# Altium project gongxuanke.PrjPcb
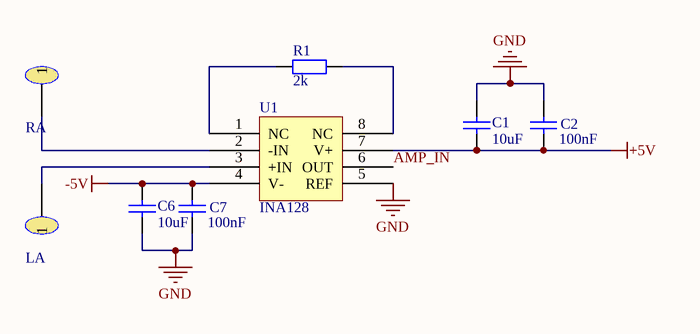
[diagram p0: 前级仪表放大.SchDoc]
13 sheets, 104 parts. Net scope: global (net labels, ports and power ports of the same name join across sheets).
Sheets:
  前级仪表放大.SchDoc
  低通&放大.SchDoc
  100Hz陷波&电平移位&放大.SchDoc
  无源高通.SchDoc
  50Hz陷波器（两次陷波）.SchDoc
  电源电路.SchDoc
  LCD.SchDoc
  启动模式.SchDoc
  晶振.SchDoc
  复位.SchDoc
  暂停.SchDoc
  下载&调试.SchDoc
  主控.SchDoc

## Sheet 前级仪表放大.SchDoc
size A4

### Parts
C1  10uF  [LC-0805_C]
C2  100nF  [LC-0805_C]
C6  10uF  [LC-0805_C]
C7  100nF  [LC-0805_C]
LA  ���Ժ���  [PAD]  (value not drawn)
R1  2k  [LC-0805_R]
RA  ���Ժ���  [PAD]  (value not drawn)
U1  INA128  [LC-SOIC-8_150mil]

### Nets
+5V: C1.2 C2.2 U1.7(V+)
-5V: C6.1 C7.1 U1.4(V-)
GND: C1.1 C2.1 C6.2 C7.2 U1.5(REF)
AMP_IN: U1.6(OUT)
NetLA_1: LA.1 U1.3(+IN)
NetR1_1: R1.1 U1.1(NC)
NetR1_2: R1.2 U1.8(NC)
NetRA_1: RA.1 U1.2(-IN)

### Library data of the parts
C1 C2 C6 C7 = Cap: 100nF��0805��50V,+/-10%
LA RA = TestPoint: ��������
R1 = Res1: 330��,0805,��5%
U1 = INA128: INA128��SO-8

## Sheet 低通&放大.SchDoc
size A4
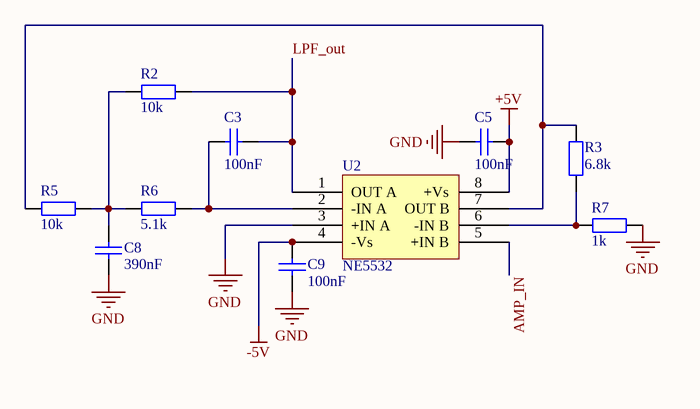
[diagram p1: 低通&放大.SchDoc]

### Parts
C3  100nF  [LC-0805_C]
C5  100nF  [LC-0805_C]
C8  390nF  [LC-0805_C]
C9  100nF  [LC-0805_C]
R2  10k  [LC-0805_R]
R3  6.8k  [LC-0805_R]
R5  10k  [LC-0805_R]
R6  5.1k  [LC-0805_R]
R7  1k  [LC-0805_R]
U2  NE5532  [DIP-8]

### Nets
+5V: C5.2 U2.8(+Vs)
-5V: C9.1 U2.4(-Vs)
GND: C5.1 C8.2 C9.2 R7.2 U2.3(+IN_A)
AMP_IN: U2.5(+IN_B)
LPF_out: C3.2 R2.2 U2.1(OUT_A)
NetC3_1: C3.1 R6.2 U2.2(-IN_A)
NetC8_1: C8.1 R2.1 R5.2 R6.1
NetR3_1: R3.1 R7.1 U2.6(-IN_B)
NetR3_2: R3.2 R5.1 U2.7(OUT_B)

### Library data of the parts
C3 C5 C8 C9 = Cap: 100nF��0805��50V,+/-10%
R2 R3 R5-R7 = R: 10k��,0805,��5%
U2 = NE5532: NE5532��SO-8

## Sheet 100Hz陷波&电平移位&放大.SchDoc
size A4
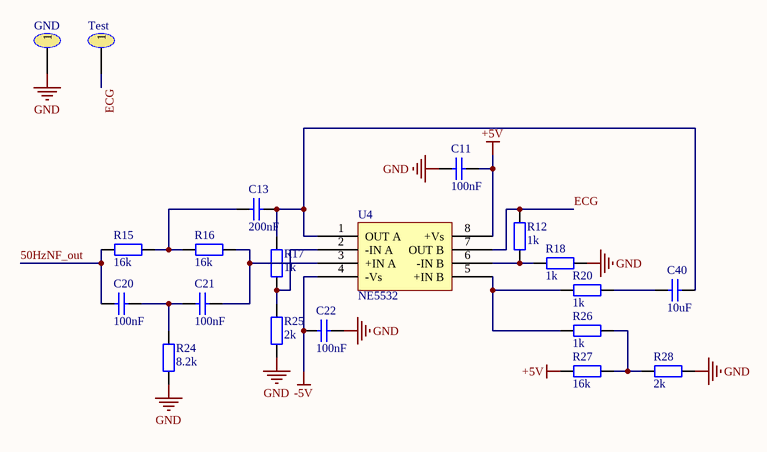
[diagram p2: 100Hz陷波&电平移位&放大.SchDoc]

### Parts
C11  100nF  [LC-0805_C]
C13  200nF  [LC-0805_C]
C20  100nF  [LC-0805_C]
C21  100nF  [LC-0805_C]
C22  100nF  [LC-0805_C]
C40  10uF  [LC-0805_C]
GND  ���Ժ���  [PAD]  (value not drawn)
R12  1k  [LC-0805_R]
R15  16k  [LC-0805_R]
R16  16k  [LC-0805_R]
R17  1k  [LC-0805_R]
R18  1k  [LC-0805_R]
R20  1k  [LC-0805_R]
R24  8.2k  [LC-0805_R]
R25  2k  [LC-0805_R]
R26  1k  [LC-0805_R]
R27  16k  [LC-0805_R]
R28  2k  [LC-0805_R]
Test  ���Ժ���  [PAD]  (value not drawn)
U4  NE5532  [DIP-8]

### Nets
+5V: C11.1 R27.2 U4.8(+Vs)
-5V: C22.2 U4.4(-Vs)
GND: C11.2 C22.1 GND.1 R18.1 R24.1 R25.1 R28.1
50HzNF_out: C20.2 R15.1
ECG: R12.2 Test.1 U4.7(OUT_B)
NetC13_1: C13.1 C40.2 R17.2 U4.1(OUT_A)
NetC13_2: C13.2 R15.2 R16.1
NetC20_1: C20.1 C21.2 R24.2
NetC21_1: C21.1 R16.2 U4.3(+IN_A)
NetC40_1: C40.1 R20.1
NetR12_1: R12.1 R18.2 U4.6(-IN_B)
NetR17_1: R17.1 R25.2 U4.2(-IN_A)
NetR20_2: R20.2 R26.2 U4.5(+IN_B)
NetR26_1: R26.1 R27.1 R28.2

### Library data of the parts
C11 C13 C20-C22 C40 = Cap: 100nF��0805��50V,+/-10%
GND Test = TestPoint: ��������
R12 R15-R18 R20 R24-R28 = R: 10k��,0805,��5%
U4 = NE5532: NE5532��SO-8

## Sheet 无源高通.SchDoc
size A4
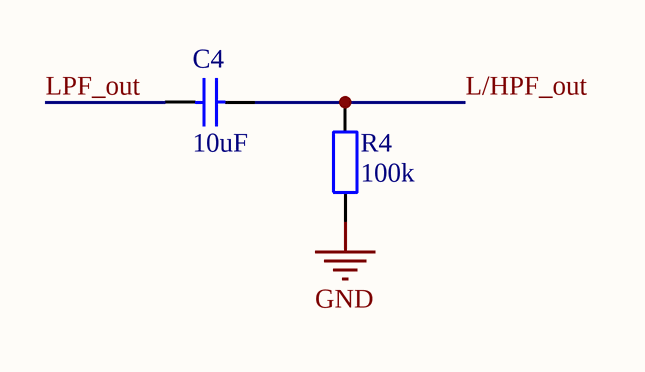
[diagram p3: 无源高通.SchDoc]

### Parts
C4  10uF  [LC-0805_C]
R4  100k  [LC-0805_R]

### Nets
GND: R4.1
L/HPF_out: C4.2 R4.2
LPF_out: C4.1

### Library data of the parts
C4 = Cap: 100nF��0805��50V,+/-10%
R4 = R: 10k��,0805,��5%

## Sheet 50Hz陷波器（两次陷波）.SchDoc
size A4
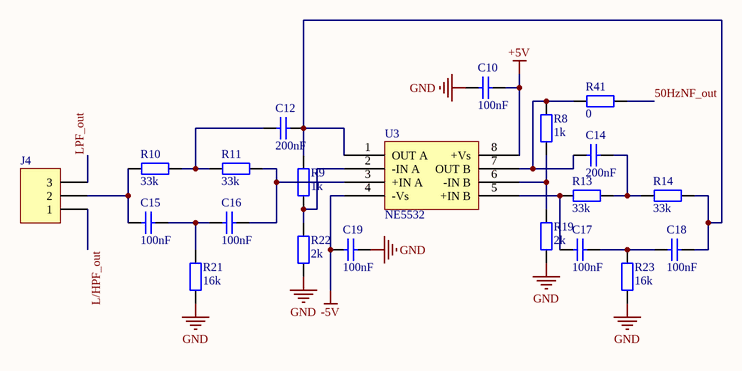
[diagram p4: 50Hz陷波器（两次陷波）.SchDoc]

### Parts
C10  100nF  [LC-0805_C]
C12  200nF  [LC-0805_C]
C14  200nF  [LC-0805_C]
C15  100nF  [LC-0805_C]
C16  100nF  [LC-0805_C]
C17  100nF  [LC-0805_C]
C18  100nF  [LC-0805_C]
C19  100nF  [LC-0805_C]
J4  ������  [HDR1X3]  (value not drawn)
R8  1k  [LC-0805_R]
R9  1k  [LC-0805_R]
R10  33k  [LC-0805_R]
R11  33k  [LC-0805_R]
R13  33k  [LC-0805_R]
R14  33k  [LC-0805_R]
R19  2k  [LC-0805_R]
R21  16k  [LC-0805_R]
R22  2k  [LC-0805_R]
R23  16k  [LC-0805_R]
R41  0  [LC-0805_R]
U3  NE5532  [DIP-8]

### Nets
+5V: C10.1 U3.8(+Vs)
-5V: C19.2 U3.4(-Vs)
GND: C10.2 C19.1 R19.1 R21.1 R22.1 R23.1
50HzNF_out: R41.2
L/HPF_out: J4.1
LPF_out: J4.3
NetC12_1: C12.1 C18.1 R9.2 R14.2 U3.1(OUT_A)
NetC12_2: C12.2 R10.2 R11.1
NetC14_1: C14.1 R13.2 R14.1
NetC14_2: C14.2 R8.2 R41.1 U3.7(OUT_B)
NetC15_1: C15.1 C16.2 R21.2
NetC15_2: C15.2 J4.2 R10.1
NetC16_1: C16.1 R11.2 U3.3(+IN_A)
NetC17_1: C17.1 C18.2 R23.2
NetC17_2: C17.2 R13.1 U3.5(+IN_B)
NetR8_1: R8.1 R19.2 U3.6(-IN_B)
NetR9_1: R9.1 R22.2 U3.2(-IN_A)

### Library data of the parts
C10 C12 C14-C19 = Cap: 100nF��0805��50V,+/-10%
J4 = Header 3: 1*3Pin,2.54mm��൥����; LatestRevisionDate: 17-Jul-2002; LatestRevisionNote: Re-released for DXP Platform.; Publisher: Altium Limited
R8-R11 R13 R14 R19 R21-R23 R41 = R: 10k��,0805,��5%
U3 = NE5532: NE5532��SO-8

## Sheet 电源电路.SchDoc
size A4
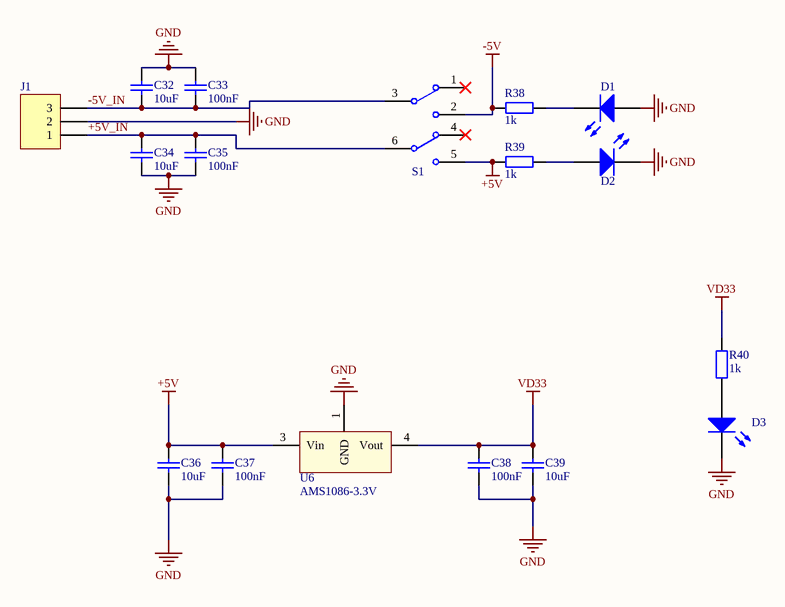
[diagram p5: 电源电路.SchDoc]

### Parts
C32  10uF  [LC-0805_C]
C33  100nF  [LC-0805_C]
C34  10uF  [LC-0805_C]
C35  100nF  [LC-0805_C]
C36  10uF  [LC-0805_C]
C37  100nF  [LC-0805_C]
C38  100nF  [LC-0805_C]
C39  10uF  [LC-0805_C]
D1  LED0  [0805-POLAR]  (value not drawn)
D2  LED0  [0805-POLAR]  (value not drawn)
D3  LED0  [0805-POLAR]  (value not drawn)
J1  ������  [HDR1X3]  (value not drawn)
R38  1k  [LC-0805_R]
R39  1k  [LC-0805_R]
R40  1k  [LC-0805_R]
S1  ��������  [DPDT-6]  (value not drawn)
U6  AMS1086-3.3V  [TO-252]

### Nets
+5V: C36.1 C37.1 R39.1 S1.5 U6.3(Vin)
-5V: R38.1 S1.2
GND: C32.1 C33.1 C34.2 C35.2 C36.2 C37.2 C38.2 C39.2 D1.1(A) D2.2(K) D3.2(K) J1.2 U6.1(GND)
VD33: C38.1 C39.1 R40.2 U6.4(Vout)
+5V_IN: C34.1 C35.1 J1.1 S1.6
-5V_IN: C32.2 C33.2 J1.3 S1.3
NetD1_2: D1.2(K) R38.2
NetD2_1: D2.1(A) R39.2
NetD3_1: D3.1(A) R40.1

Not connected (* = marked no-connect by the designer): S1 1* 4*

### Library data of the parts
C32-C39 = Cap: 100nF��0805��50V,+/-10%
D1-D3 = LED0: ��������ܣ�0805���׷��̹�; Published: 8-Jun-2000; LatestRevisionDate: 08-Jul-2005; LatestRevisionNote: Mech Layer 1 removed.; PackageReference: LED-0; Publisher: Altium Limited; PackageDescription: LED; 2 Leads
J1 = Header 3: 1*3Pin,2.54mm��൥����; LatestRevisionDate: 17-Jul-2002; LatestRevisionNote: Re-released for DXP Platform.; Publisher: Altium Limited
R38-R40 = R: 10k��,0805,��5%
S1 = SW-6: 8*8mm����˫·��������
U6 = AMS1086-3.3: AMS1086-3.3V,TO252��װ

## Sheet LCD.SchDoc
size A4
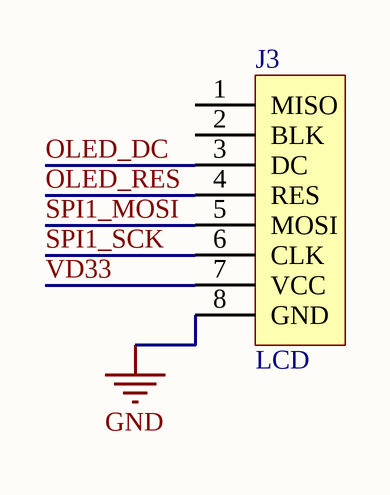
[diagram p6: LCD.SchDoc]

### Parts
J3  LCD  [HDR1X8]

### Nets
GND: J3.8(GND)
VD33: J3.7(VCC)
OLED_DC: J3.3(DC)
OLED_RES: J3.4(RES)
SPI1_MOSI: J3.5(MOSI)
SPI1_SCK: J3.6(CLK)

Not connected (* = marked no-connect by the designer): J3 1(MISO) 2(BLK)

### Library data of the parts
J3 = OLED: 1*8Pin 2.54mm��൥����

## Sheet 启动模式.SchDoc
size A4
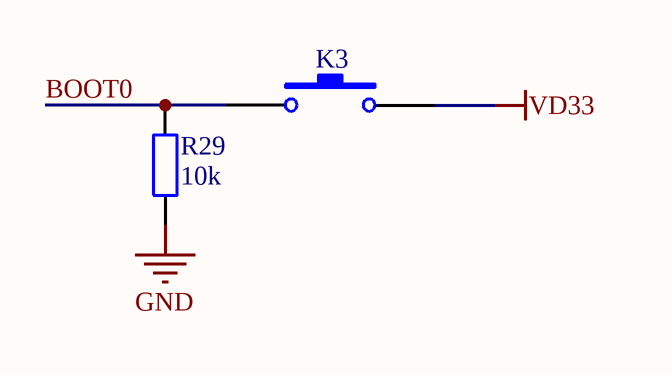
[diagram p7: 启动模式.SchDoc]

### Parts
K3  �ᴥ����  [SW6X6]  (value not drawn)
R29  10k  [LC-0805_R]

### Nets
GND: R29.1
VD33: K3.2
BOOT0: K3.1 R29.2

### Library data of the parts
K3 = SW-PB: �ᴥ����6��6mm,�Ľǲ��; Published: 24-Mar-1999; LatestRevisionDate: 17-Jul-2002; LatestRevisionNote: Re-released for DXP Platform.; PackageReference: SPST-2; Publisher: Altium Limited; PackageDescription: Switch; 2 Leads
R29 = R: 10k��,0805,��5%

## Sheet 晶振.SchDoc
size A4
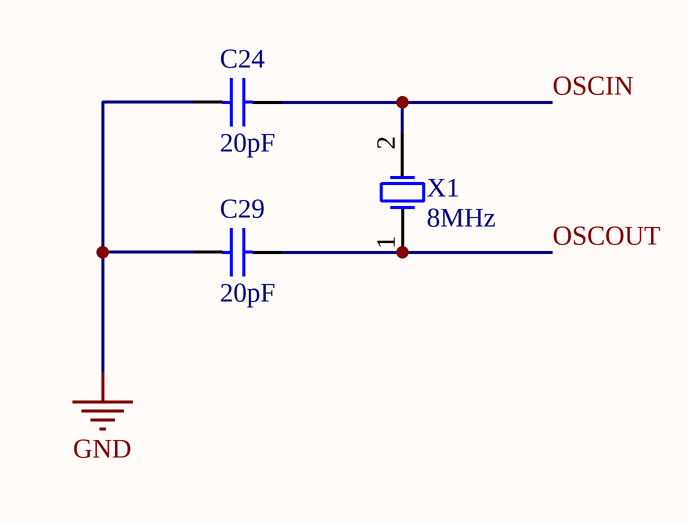
[diagram p8: 晶振.SchDoc]

### Parts
C24  20pF  [LC-0805_C]
C29  20pF  [LC-0805_C]
X1  8MHz  [XTAL_US]

### Nets
GND: C24.1 C29.1
OSCIN: C24.2 X1.2(OSC2)
OSCOUT: C29.2 X1.1(OSC1)

### Library data of the parts
C24 C29 = Cap: 100nF��0805��50V,+/-10%
X1 = XTAL: 8MHz����49S

## Sheet 复位.SchDoc
size A4
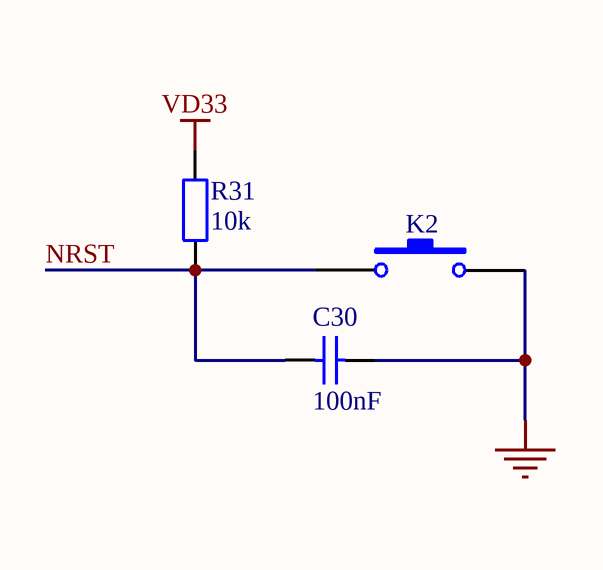
[diagram p9: 复位.SchDoc]

### Parts
C30  100nF  [LC-0805_C]
K2  �ᴥ����  [SW6X6]  (value not drawn)
R31  10k  [LC-0805_R]

### Nets
NetC30_2: C30.2 K2.2
VD33: R31.2
NRST: C30.1 K2.1 R31.1

### Library data of the parts
C30 = Cap: 100nF��0805��50V,+/-10%
K2 = SW-PB: �ᴥ����6��6mm,�Ľǲ��; Published: 24-Mar-1999; LatestRevisionDate: 17-Jul-2002; LatestRevisionNote: Re-released for DXP Platform.; PackageReference: SPST-2; Publisher: Altium Limited; PackageDescription: Switch; 2 Leads
R31 = R: 10k��,0805,��5%

## Sheet 暂停.SchDoc
size A4
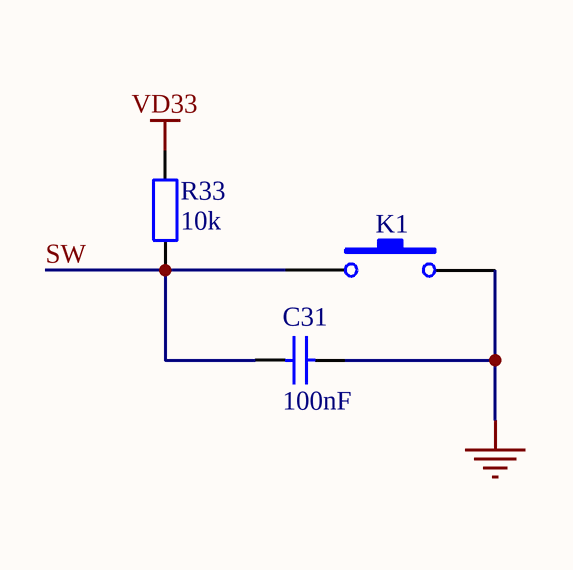
[diagram p10: 暂停.SchDoc]

### Parts
C31  100nF  [LC-0805_C]
K1  �ᴥ����  [SW6X6]  (value not drawn)
R33  10k  [LC-0805_R]

### Nets
NetC30_2: C31.2 K1.2
VD33: R33.2
SW: C31.1 K1.1 R33.1

### Library data of the parts
C31 = Cap: 100nF��0805��50V,+/-10%
K1 = SW-PB: �ᴥ����6��6mm,�Ľǲ��; Published: 24-Mar-1999; LatestRevisionDate: 17-Jul-2002; LatestRevisionNote: Re-released for DXP Platform.; PackageReference: SPST-2; Publisher: Altium Limited; PackageDescription: Switch; 2 Leads
R33 = R: 10k��,0805,��5%

## Sheet 下载&调试.SchDoc
size A4
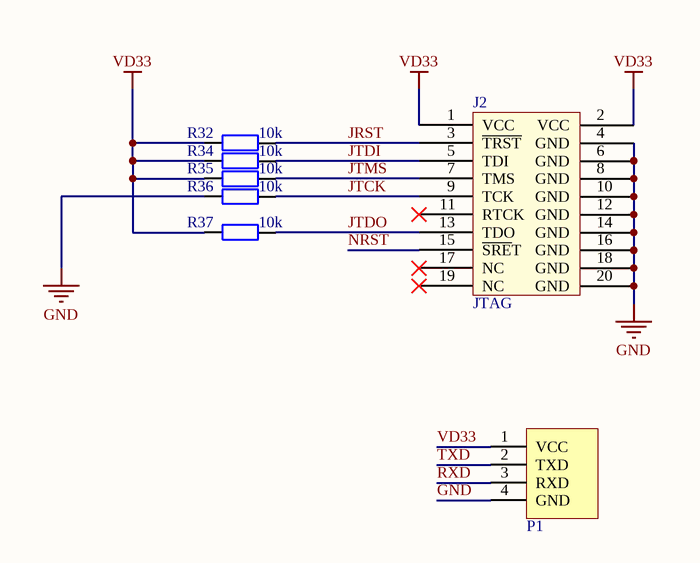
[diagram p11: 下载&调试.SchDoc]

### Parts
J2  JTAG  [JTAG_20]
P1  UART  [�������ؽӿ�]  (value not drawn)
R32  10k  [LC-0805_R]
R34  10k  [LC-0805_R]
R35  10k  [LC-0805_R]
R36  10k  [LC-0805_R]
R37  10k  [LC-0805_R]

### Nets
GND: J2.4(GND) J2.6(GND) J2.8(GND) J2.10(GND) J2.12(GND) J2.14(GND) J2.16(GND) J2.18(GND) J2.20(GND) P1.4(GND) R36.1
VD33: J2.1(VCC) J2.2(VCC) P1.1(VCC) R32.1 R34.1 R35.1 R37.1
JRST: J2.3(~{TRST}) R32.2
JTCK: J2.9(TCK) R36.2
JTDI: J2.5(TDI) R34.2
JTDO: J2.13(TDO) R37.2
JTMS: J2.7(TMS) R35.2
NRST: J2.15(~{SRE}T)
RXD: P1.3(RXD)
TXD: P1.2(TXD)

Not connected (* = marked no-connect by the designer): J2 11(RTCK)* 17(NC)* 19(NC)*

### Library data of the parts
J2 = JTAG: 2*10Pin,Jtag����
R32 R34-R37 = R: 10k��,0805,��5%

## Sheet 主控.SchDoc
size A4
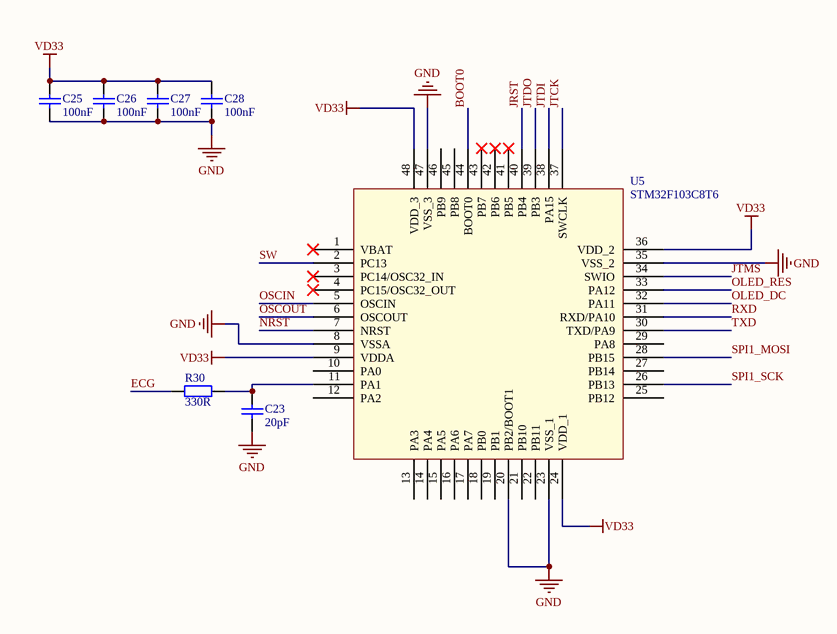
[diagram p12: 主控.SchDoc]

### Parts
C23  20pF  [LC-0805_C]
C25  100nF  [LC-0805_C]
C26  100nF  [LC-0805_C]
C27  100nF  [LC-0805_C]
C28  100nF  [LC-0805_C]
R30  330R  [LC-0805_R]
U5  STM32F103C8T6  [LQFP48]

### Nets
GND: C23.2 C25.2 C26.2 C27.2 C28.2 U5.8(VSSA) U5.20(PB2/BOOT1) U5.23(VSS_1) U5.35(VSS_2) U5.47(VSS_3)
VD33: C25.1 C26.1 C27.1 C28.1 U5.9(VDDA) U5.24(VDD_1) U5.36(VDD_2) U5.48(VDD_3)
BOOT0: U5.44(BOOT0)
ECG: R30.1
JRST: U5.40(PB4)
JTCK: U5.37(SWCLK)
JTDI: U5.38(PA15)
JTDO: U5.39(PB3)
JTMS: U5.34(SWIO)
NRST: U5.7(NRST)
OLED_DC: U5.32(PA11)
OLED_RES: U5.33(PA12)
OSCIN: U5.5(OSCIN)
OSCOUT: U5.6(OSCOUT)
RXD: U5.31(RXD/PA10)
SPI1_MOSI: U5.28(PB15)
SPI1_SCK: U5.26(PB13)
SW: U5.2(PC13)
TXD: U5.30(TXD/PA9)
NetC23_1: C23.1 R30.2 U5.11(PA1)

Not connected (* = marked no-connect by the designer): U5 1(VBAT)* 3(PC14/OSC32_IN)* 4(PC15/OSC32_OUT)* 10(PA0) 12(PA2) 13(PA3) 14(PA4) 15(PA5) 16(PA6) 17(PA7) 18(PB0) 19(PB1) 21(PB10) 22(PB11) 25(PB12) 27(PB14) 29(PA8) 41(PB5)* 42(PB6)* 43(PB7)* 45(PB8) 46(PB9)

### Library data of the parts
C23 C25-C28 = Cap: 100nF��0805��50V,+/-10%
R30 = Res1: 330��,0805,��5%
U5 = STM32F103C8T6: STM32F103C8T6,LQFP48

## Nets that join several sheets
+5V: 前级仪表放大 (C1.2 C2.2 U1.7), 低通&放大 (C5.2 U2.8), 100Hz陷波&电平移位&放大 (C11.1 R27.2 U4.8), 50Hz陷波器（两次陷波） (C10.1 U3.8), 电源电路 (5 pins)
-5V: 前级仪表放大 (C6.1 C7.1 U1.4), 低通&放大 (C9.1 U2.4), 100Hz陷波&电平移位&放大 (C22.2 U4.4), 50Hz陷波器（两次陷波） (C19.2 U3.4), 电源电路 (R38.1 S1.2)
GND: 前级仪表放大 (5 pins), 低通&放大 (5 pins), 100Hz陷波&电平移位&放大 (7 pins), 无源高通 (R4.1), 50Hz陷波器（两次陷波） (6 pins), 电源电路 (13 pins), LCD (J3.8), 启动模式 (R29.1), 晶振 (C24.1 C29.1), 下载&调试 (11 pins), 主控 (10 pins)
NetC30_2: 复位 (C30.2 K2.2), 暂停 (C31.2 K1.2)
VD33: 电源电路 (C38.1 C39.1 R40.2 U6.4), LCD (J3.7), 启动模式 (K3.2), 复位 (R31.2), 暂停 (R33.2), 下载&调试 (7 pins), 主控 (8 pins)
50HzNF_out: 100Hz陷波&电平移位&放大 (C20.2 R15.1), 50Hz陷波器（两次陷波） (R41.2)
AMP_IN: 前级仪表放大 (U1.6), 低通&放大 (U2.5)
BOOT0: 启动模式 (K3.1 R29.2), 主控 (U5.44)
ECG: 100Hz陷波&电平移位&放大 (R12.2 Test.1 U4.7), 主控 (R30.1)
JRST: 下载&调试 (J2.3 R32.2), 主控 (U5.40)
JTCK: 下载&调试 (J2.9 R36.2), 主控 (U5.37)
JTDI: 下载&调试 (J2.5 R34.2), 主控 (U5.38)
JTDO: 下载&调试 (J2.13 R37.2), 主控 (U5.39)
JTMS: 下载&调试 (J2.7 R35.2), 主控 (U5.34)
L/HPF_out: 无源高通 (C4.2 R4.2), 50Hz陷波器（两次陷波） (J4.1)
LPF_out: 低通&放大 (C3.2 R2.2 U2.1), 无源高通 (C4.1), 50Hz陷波器（两次陷波） (J4.3)
NRST: 复位 (C30.1 K2.1 R31.1), 下载&调试 (J2.15), 主控 (U5.7)
OLED_DC: LCD (J3.3), 主控 (U5.32)
OLED_RES: LCD (J3.4), 主控 (U5.33)
OSCIN: 晶振 (C24.2 X1.2), 主控 (U5.5)
OSCOUT: 晶振 (C29.2 X1.1), 主控 (U5.6)
RXD: 下载&调试 (P1.3), 主控 (U5.31)
SPI1_MOSI: LCD (J3.5), 主控 (U5.28)
SPI1_SCK: LCD (J3.6), 主控 (U5.26)
SW: 暂停 (C31.1 K1.1 R33.1), 主控 (U5.2)
TXD: 下载&调试 (P1.2), 主控 (U5.30)